# EAGLE design Transistor Tester (EAGLE 6.4)
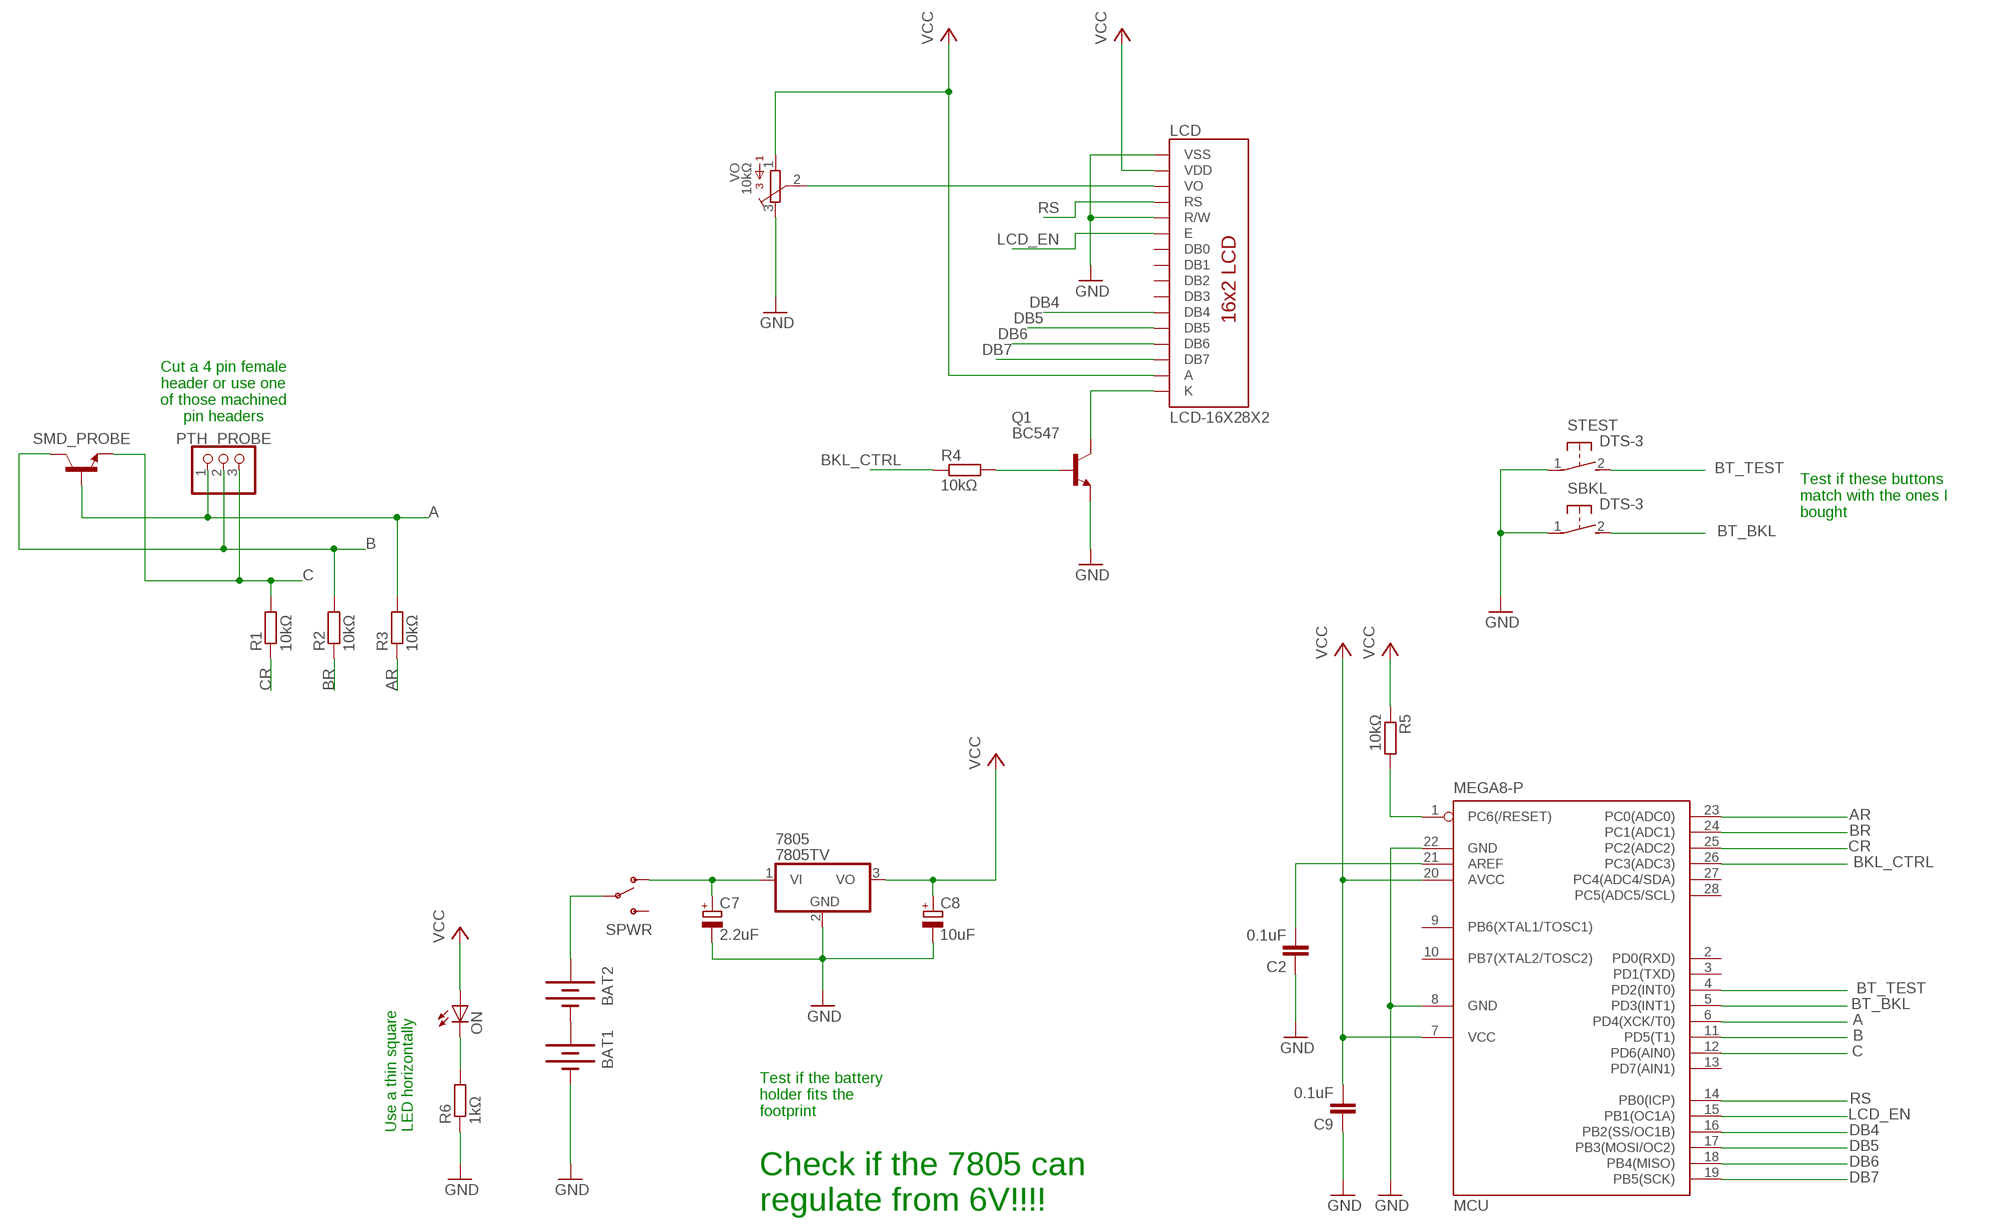
[diagram p0: schematic, sheet 1]

## Parts
7805  7805TV  [TO220V]
BAT1  20mm coincell  BATTERY20MM_4LEGS  [BATTCON_20MM_4LEGS]
BAT2  20mm coincell  BATTERY20MM_4LEGS  [BATTCON_20MM_4LEGS]
C2  0.1uF  C-EU025-025X050  [C025-025X050]
C7  2.2uF  CPOL-EUE2.5-6  [E2,5-6]
C8  10uF  CPOL-EUE2.5-6  [E2,5-6]
C9  0.1uF  C-EU050-025X075  [C050-025X075]
LCD  LCD-16X28X2  [LCD-8X2]
MCU  MEGA8-P  [DIL28-3]
ON  LED3MM  [LED3MM]
PTH_PROBE  PINHD-1X3  [1X03]
Q1  BC547  [TO92]
R1  10kΩ  R-EU_0207/10  [0207/10]
R2  10kΩ  R-EU_0207/10  [0207/10]
R3  10kΩ  R-EU_0207/10  [0207/10]
R4  10kΩ  R-EU_0207/10  [0207/10]
R5  10kΩ  R-EU_0207/10  [0207/10]
R6  1kΩ  R-EU_0207/10  [0207/10]
SBKL  DTS-3  [DTS-3]
SMD_PROBE  BC817-25SMD  [SOT23-BEC]
SPWR  SWITCH-SPDTPTH  [SWITCH-SPDT]
STEST  DTS-3  [DTS-3]
VO  10kΩ  3362H  [3362H]

## Nets
A: MCU.6(PD4(XCK/T0)) PTH_PROBE.1 R3.2 SMD_PROBE.B
AR: MCU.23(PC0(ADC0)) R3.1
B: MCU.11(PD5(T1)) PTH_PROBE.2 R2.2 SMD_PROBE.C
BKL_CTRL: MCU.26(PC3(ADC3)) R4.1
BR: MCU.24(PC1(ADC1)) R2.1
BT_BKL: MCU.5(PD3(INT1)) SBKL.2
BT_TEST: MCU.4(PD2(INT0)) STEST.2
C: MCU.12(PD6(AIN0)) PTH_PROBE.3 R1.2 SMD_PROBE.E
CR: MCU.25(PC2(ADC2)) R1.1
DB4: LCD.11(DB4) MCU.16(PB2(SS/OC1B))
DB5: LCD.12(DB5) MCU.17(PB3(MOSI/OC2))
DB6: LCD.13(DB6) MCU.18(PB4(MISO))
DB7: LCD.14(DB7) MCU.19(PB5(SCK))
GND: 7805.2(GND) BAT1.2(-) C2.1 C7.- C8.- C9.1 LCD.1(VSS) LCD.5(R/W) MCU.8(GND) MCU.22(GND) Q1.1(E) R6.1 SBKL.1 STEST.1 VO.3
LCD_EN: LCD.6(E) MCU.15(PB1(OC1A))
N$1: BAT1.1(+) BAT2.2(-)
N$2: C2.2 MCU.21(AREF)
N$3: LCD.16(K) Q1.3(C)
N$4: Q1.2(B) R4.2
N$5: ON.K(C) R6.2
N$6: BAT2.1(+) SPWR.2(P)
N$7: 7805.1(VI) C7.+ SPWR.1(O)
N$10: LCD.3(VO) VO.2
RESET: MCU.1(PC6(/RESET)) R5.2
RS: LCD.4(RS) MCU.14(PB0(ICP))
VCC: 7805.3(VO) C8.+ C9.2 LCD.2(VDD) LCD.15(A) MCU.7(VCC) MCU.20(AVCC) ON.A R5.1 VO.1
Unconnected: LCD.7(DB0) LCD.8(DB1) LCD.9(DB2) LCD.10(DB3) MCU.2(PD0(RXD)) MCU.3(PD1(TXD)) MCU.9(PB6(XTAL1/TOSC1)) MCU.10(PB7(XTAL2/TOSC2)) MCU.13(PD7(AIN1)) MCU.27(PC4(ADC4/SDA)) MCU.28(PC5(ADC5/SCL)) SPWR.3(S)

## Notes on the sheet
- Cut a 4 pin female
  header or use one
  of those machined
  pin headers
- Test if these buttons
  match with the ones I
  bought
- Test if the battery
  holder fits the
  footprint
- Use a thin square
  LED horizontally
- Check if the 7805 can
  regulate from 6V!!!!

## Library data of the parts
7805 = linear:78*: Positive VOLTAGE REGULATOR Source: http://cache.national.com/ds/LM/LM78L05.pdf http://www.fairchildsemi.com/ds/LM/LM7805.pdf
BAT1 BAT2 = SparkFun-Electromechanical:BATTERY: Battery Holders Various common sizes : AA, AAA, 20mm coin cell and 12mm coin cell. 20MM_4LEGS, BATT-10373; PROD_ID: BATT-10373
C2 C9 = rcl:C-EU: CAPACITOR, European symbol
C7 C8 = rcl:CPOL-EU: POLARIZED CAPACITOR, European symbol
LCD = SparkFun-Displays:LCD-16X2: Standard text-only 16x2 parallel input LCD
MCU = atmel:MEGA8-P: MICROCONTROLLER 8 Kbytes FLASH, 1 kbytes SRAM, 512 bytes EEPROM, USART, 4-channel 10 bit ADC, 2-channel 8 bit ADC Pin compatible with Atmega48, ATMega88, ATMega168 Source: avr.lbr; OC_FARNELL: unknown; OC_NEWARK: unknown
ON = led:LED: LED OSRAM: - CHIPLED LG R971, LG N971, LY N971, LG Q971, LY Q971, LO R971, LY R971 LH N974, LH R974 LS Q976, LO Q976, LY Q976 LO Q996 - Hyper CHIPLED LW Q18S LB Q993, LB Q99A, LB R99A - SideLED LS A670, LO A670, LY A670, LG A670, LP A670 LB A673, LV A673, LT A673, LW A673 LH A674 LY A675 LS A676, LA A676, LO A676, LY A676, LW A676 LS A679, LY A679, LG A679 - Hyper Micro SIDELED® LS Y876, LA Y876, LO Y876, LY Y876 LT Y87S - SmartLED LW L88C, LW L88S LB L89C, LB L89S, LG L890 LS L89K, LO L89K, LY L89K LS L896, LA L896, LO L896, LY L896 - TOPLED LS T670, LO T670, LY T670, LG T670, LP T670 LSG T670, LSP T670, LSY T670, LOP T670, LYG T670 LG T671, LOG T671, LSG T671 LB T673, LV T673, LT T673, LW T673 LH T674 LS T676, LA T676, LO T676, LY T676, LB T676, LH T676, LSB T676, LW T676 LB T67C, LV T67C, LT T67C, LS T67K, LO T67K, LY T67K, LW E67C LS E67B, LA E67B, LO E67B, LY E67B, LB E67C, LV E67C, LT E67C LW T67C LS T679, LY T679, LG T679 LS T770, LO T770, LY T770, LG T770, LP T770 LB T773, LV T773, LT T773, LW T773 LH T774 LS E675, LA E675, LY E675, LS T675 LS T776, LA T776, LO T776, LY T776, LB T776 LHGB T686 LT T68C, LB T68C - Hyper Mini TOPLED® LB M676 - Mini TOPLED Santana® LG M470 LS M47K, LO M47K, LY M47K Source: http://www.osram.convergy.de LUXEON: - LUMILED® LXK2-PW12-R00, LXK2-PW12-S00, LXK2-PW14-U00, LXK2-PW14-V00 LXK2-PM12-R00, LXK2-PM12-S00, LXK2-PM14-U00 LXK2-PE12-Q00, LXK2-PE12-R00, LXK2-PE12-S00, LXK2-PE14-T00, LXK2-PE14-U00 LXK2-PB12-K00, LXK2-PB12-L00, LXK2-PB12-M00, LXK2-PB14-N00, LXK2-PB14-P00, LXK2-PB14-Q00 LXK2-PR12-L00, LXK2-PR12-M00, LXK2-PR14-Q00, LXK2-PR14-R00 LXK2-PD12-Q00, LXK2-PD12-R00, LXK2-PD12-S00 LXK2-PH12-R00, LXK2-PH12-S00 LXK2-PL12-P00, LXK2-PL12-Q00, LXK2-PL12-R00 Source: www.luxeon.com KINGBRIGHT: KA-3528ASYC Source: www.kingbright.com
PTH_PROBE = pinhead:PINHD-1X3: PIN HEADER
Q1 = transistor-npn:BC547*: NPN Transistor
R1-R3 = resistor:R-EU_: RESISTOR, European symbol
R4-R6 = rcl:R-EU_: RESISTOR, European symbol
SBKL STEST = switch-tact:DTS-3
SMD_PROBE = transistor-npn:BC817*: NPN Transistor
SPWR = SparkFun-Electromechanical:SWITCH-SPDT: SPDT Switch Simple slide switch, Spark Fun Electronics SKU : COM-00102 DPDT SMT slide switch, AYZ0202, SWCH-08179
VO = bourns:3362: 3362 Series 1/4" Square Trimmer

## Board
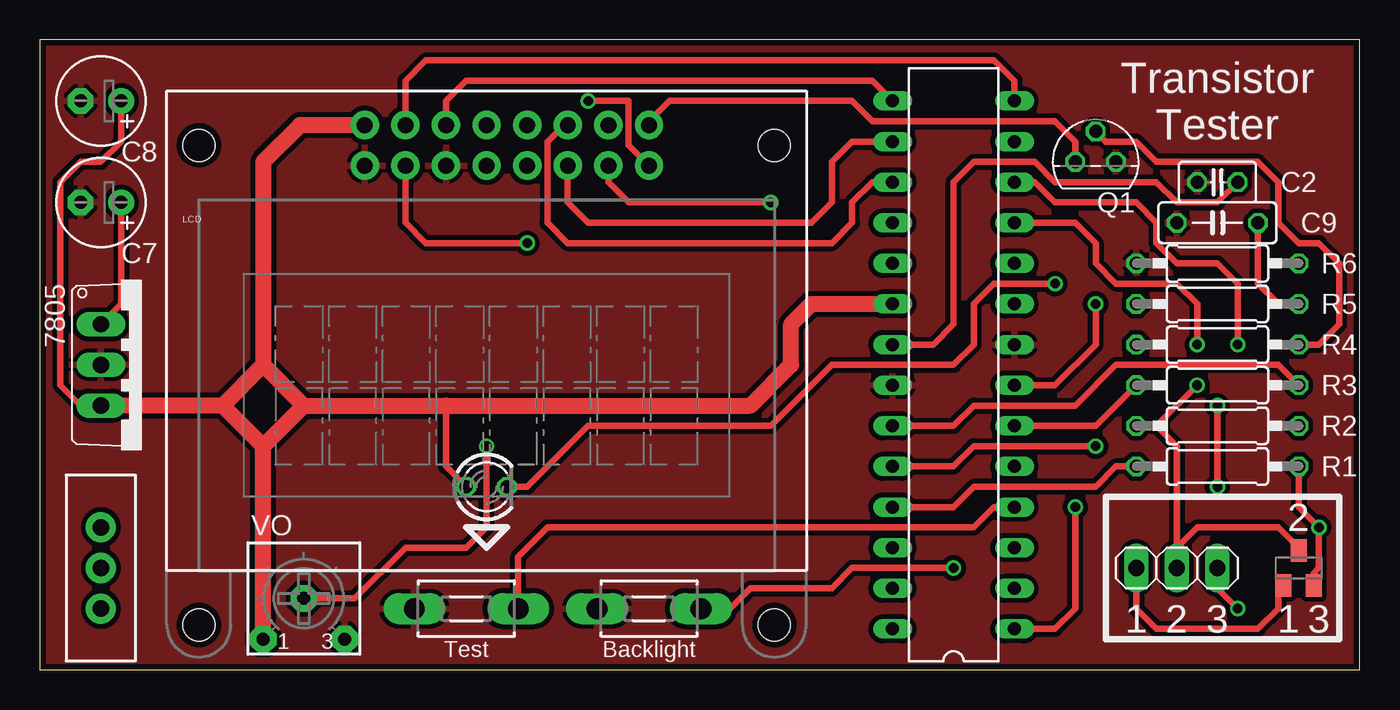
[diagram p1: board, top side]
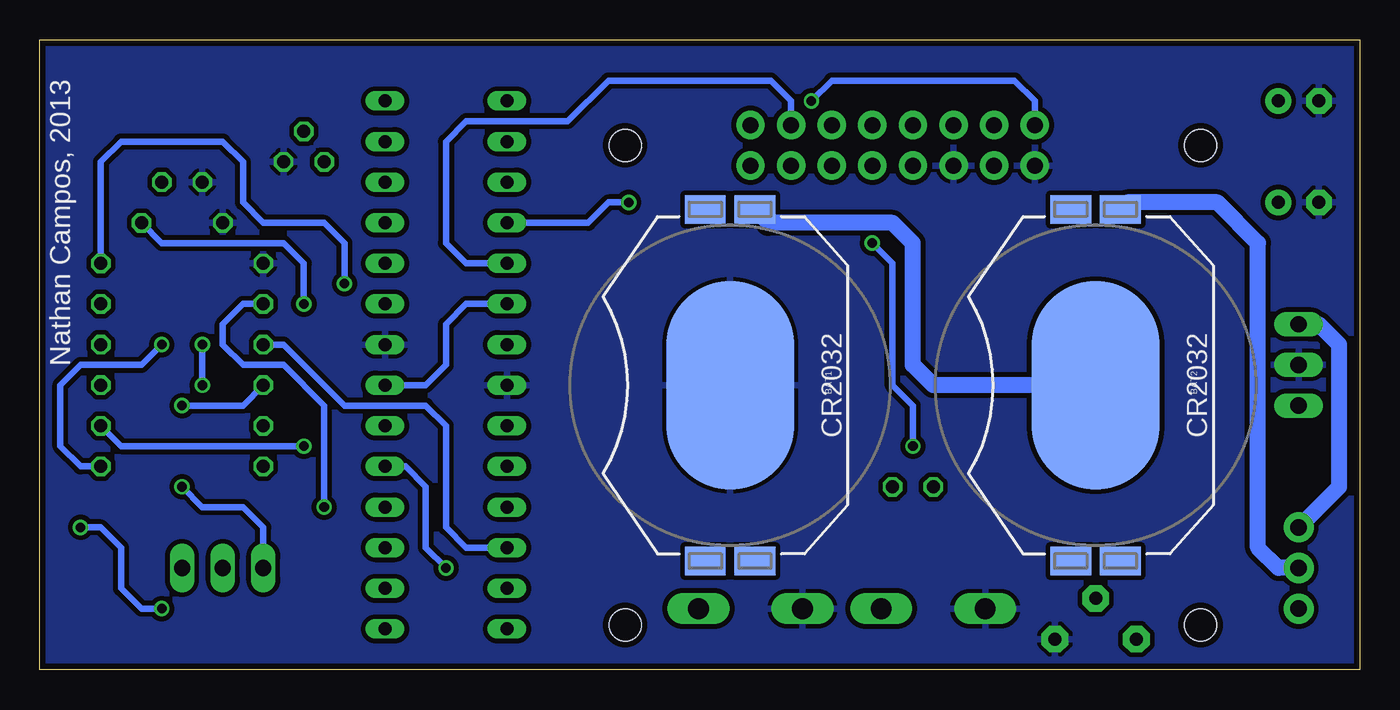
[diagram p2: board, bottom side, seen from below]

Size 82.55 x 39.37 mm. Coordinates in mm from the lower left corner, seen from the top.
Outline: 0,0 82.55,0 82.55,39.37 0,39.37 0,0
Copper layers (1*16): Top 0.0356mm / dielectric 1.5011mm / Bottom 0.0356mm
Design rules "LaenPCBOrder": minimum track width 6mil, minimum drill 13mil, track to track 6mil, track to pad 6mil, pad to pad 6mil, via to via 6mil, smd to smd 6mil, copper to edge 15mil, drill to drill 6mil, minimum pad ring 7mil, minimum via ring 7mil, stop-mask expansion 4mil, vias tented up to drill 0mil, thermal gap 10mil

### Footprints (pad centres in the part's own frame; a part is rotated, then mirrored left to right if it is on the bottom)
TO220V = drill 1.016 long: 1 -2.54,-2.54; 2 0,-2.54; 3 2.54,-2.54
BATTCON_20MM_4LEGS = smd 1.778 x 2.54: 1 -11,1.55; 3 11,1.55; P$1 -11,-1.55; P$2 11,-1.55 | smd 13 x 8: 2 0,0
C025-025X050 = drill 0.813 octagon: 1 -1.27,0; 2 1.27,0
E2,5-6 = drill 0.813 pad 1.6: + -1.27,0 | drill 0.813 pad 1.6 octagon: - 1.27,0
C050-025X075 = drill 0.813 octagon: 1 -2.54,0; 2 2.54,0
LCD-8X2 = drill 1 pad 1.778: 1 -7.62,13.73; 2 -7.62,16.27; 3 -5.08,13.73; 4 -5.08,16.27; 5 -2.54,13.73; 6 -2.54,16.27; 7 0,13.73; 8 0,16.27; 9 2.54,13.73; 10 2.54,16.27; 11 5.08,13.73; 12 5.08,16.27; 13 7.62,13.73; 14 7.62,16.27; 15 10.16,13.73; 16 10.16,16.27 | hole 2: 18,15; -18,15; -18,-15; 18,-15
DIL28-3 = drill 0.813 long: 1 -16.51,-3.81; 2 -13.97,-3.81; 3 -11.43,-3.81; 4 -8.89,-3.81; 5 -6.35,-3.81; 6 -3.81,-3.81; 7 -1.27,-3.81; 8 1.27,-3.81; 9 3.81,-3.81; 10 6.35,-3.81; 11 8.89,-3.81; 12 11.43,-3.81; 13 13.97,-3.81; 14 16.51,-3.81; 15 16.51,3.81; 16 13.97,3.81; 17 11.43,3.81; 18 8.89,3.81; 19 6.35,3.81; 20 3.81,3.81; 21 1.27,3.81; 22 -1.27,3.81; 23 -3.81,3.81; 24 -6.35,3.81; 25 -8.89,3.81; 26 -11.43,3.81; 27 -13.97,3.81; 28 -16.51,3.81
LED3MM = drill 0.813 octagon: A -1.27,0; K 1.27,0
1X03 = drill 1.016 long: 1 -2.54,0; 2 0,0; 3 2.54,0
TO92 = drill 0.813 octagon: 1 1.27,0; 2 0,1.905; 3 -1.27,0
0207/10 = drill 0.813 octagon: 1 -5.08,0; 2 5.08,0
DTS-3 = drill 1.3 long: 1 -3.25,0; 2 3.25,0
SOT23-BEC = smd 1 x 1.4: B -0.95,-1.1; C 0,1.1; E 0.95,-1.1
SWITCH-SPDT = drill 1.016 pad 1.88: 1 0,2.54; 2 0,0; 3 0,-2.54
3362H = drill 0.813 pad 1.676 octagon: 1 -2.54,-3.175; 2 0,-0.635; 3 2.54,-3.175

### Placement (x,y rotation side)
7805  6.35,19.05 270 top
BAT1  39.37,17.78 270 bottom
BAT2  16.51,17.78 270 bottom
C2  73.66,30.48 0 top
C7  3.81,29.21 180 top
C8  3.81,35.56 180 top
C9  73.66,27.94 0 top
LCD  27.94,17.78 0 top
MCU  57.15,19.05 90 top
ON  27.94,11.43 0 top
PTH_PROBE  71.12,6.35 0 top
Q1  66.04,31.75 0 top
R1  73.66,12.7 0 top
R2  73.66,15.24 180 top
R3  73.66,17.78 180 top
R4  73.66,20.32 0 top
R5  73.66,22.86 180 top
R6  73.66,25.4 0 top
SBKL  38.1,3.81 0 top
SMD_PROBE  78.74,6.35 0 top
SPWR  3.81,6.35 0 top
STEST  26.67,3.81 0 top
VO  16.51,5.08 0 top

### Tracks (layer width: path | path; a pad name or v marks a point on that pad's centre or on a via)
A  (via drill 0.6)
  Top 0.406: PTH_PROBE.1 68.58,3.81 69.85,2.54 76.2,2.54 77.47,3.81 77.47,4.93 SMD_PROBE.B | MCU.6 66.04,15.24 R3.2 | v73.66,16.51 v73.66,11.43
  Bottom 0.406: R3.2 69.85,16.51 v73.66,16.51 | PTH_PROBE.1 68.58,8.89 69.85,10.16 72.39,10.16 v73.66,11.43
AR
  Top 0.406: MCU.23 57.15,15.24 58.42,16.51 64.77,16.51 67.31,19.05 77.47,19.05 R3.1
B  (via drill 0.6)
  Top 0.406: PTH_PROBE.2 71.12,7.62 | 71.12,7.62 72.39,8.89 77.47,8.89 78.74,7.62 SMD_PROBE.C | 69.85,15.24 71.12,13.97 71.12,7.62 | MCU.11 64.77,27.94 66.04,26.67 66.04,25.4 67.31,24.13 71.12,24.13 72.39,22.86 v72.39,20.32 | R2.2 69.85,15.24 | 69.85,15.24 v72.39,17.78
  Bottom 0.406: v72.39,17.78 v72.39,20.32
BKL_CTRL
  Bottom 0.406: MCU.26 55.88,7.62 57.15,8.89 57.15,15.24 58.42,16.51 63.5,16.51 67.31,20.32 R4.1
BR  (via drill 0.6)
  Top 0.406: MCU.24 57.15,12.7 58.42,13.97 v66.04,13.97
  Bottom 0.406: R2.1 77.47,13.97 v66.04,13.97
BT_BKL  (via drill 0.6)
  Top 0.406: SBKL.2 43.18,3.81 44.45,5.08 49.53,5.08 50.8,6.35 v57.15,6.35
  Bottom 0.406: MCU.5 59.69,12.7 58.42,11.43 58.42,7.62 v57.15,6.35
BT_TEST
  Top 0.406: STEST.2 29.92,7.06 31.75,8.89 58.42,8.89 59.69,10.16 MCU.4
C  (via drill 0.6)
  Top 0.406: PTH_PROBE.3 73.66,5.08 v74.93,3.81 | SMD_PROBE.E 79.69,6.03 80.01,6.35 v80.01,8.89 78.74,10.16 R1.2 | MCU.12 62.23,30.48 63.5,29.21 68.58,29.21 69.85,27.94 69.85,26.67 71.12,25.4 73.66,25.4 74.93,24.13 v74.93,20.32
  Bottom 0.406: v74.93,3.81 76.2,3.81 77.47,5.08 77.47,7.62 78.74,8.89 v80.01,8.89 | R1.2 80.01,12.7 81.28,13.97 81.28,17.78 80.01,19.05 76.2,19.05 v74.93,20.32
CR
  Top 0.406: R1.1 67.31,12.7 66.04,11.43 58.42,11.43 57.15,10.16 MCU.25
DB4
  Top 0.406: LCD.11 33.02,29.21 34.29,27.94 48.26,27.94 49.53,29.21 49.53,31.75 50.8,33.02 MCU.16
DB5
  Top 0.406: LCD.12 32.78,34.05 31.75,33.02 31.75,27.94 33.02,26.67 49.53,26.67 50.8,27.94 50.8,29.21 52.07,30.48 MCU.17
DB6  (via drill 0.6)
  Top 0.406: LCD.13 35.56,30.48 36.83,29.21 v45.72,29.21
  Bottom 0.406: v45.72,29.21 46.99,29.21 48.26,27.94 MCU.18
DB7
  Bottom 0.406: LCD.14 35.56,35.56 36.83,36.83 46.99,36.83 49.53,34.29 55.88,34.29 57.15,33.02 57.15,26.67 55.88,25.4 MCU.19
GND
  pour Top (isolate 0.305): 0,39.37 82.55,39.37 82.55,0 0,0
  pour Bottom (isolate 0.305): 0,0 0,39.37 82.55,39.37 82.55,0
LCD_EN
  Top 0.406: LCD.6 25.4,35.56 26.67,36.83 52.07,36.83 MCU.15
N$1
  Bottom 1.016: BAT2.2 26.67,17.78 27.94,19.05 27.94,26.67 29.21,27.94 36.98,27.94 BAT1.1
N$2
  Top 0.406: MCU.21 55.88,20.32 57.15,21.59 57.15,30.48 58.42,31.75 62.23,31.75 63.5,30.48 69.85,30.48 71.12,29.21 73.66,29.21 C2.2
N$3
  Top 0.406: LCD.16 38.1,34.29 39.37,35.56 50.8,35.56 52.07,34.29 63.5,34.29 64.77,33.02 Q1.3
N$4
  Top 0.406: Q1.2 66.67,33.02 68.58,33.02 69.85,31.75 76.2,31.75 77.47,30.48 77.47,27.94 78.74,26.67 80.01,26.67 81.28,25.4 81.28,21.59 80.01,20.32 R4.2
N$5  (via drill 0.6)
  Top 0.406: ON.K 30.48,11.43 34.29,15.24 45.72,15.24 49.53,19.05 57.15,19.05 58.42,20.32 58.42,22.86 59.69,24.13 v63.5,24.13
  Bottom 0.406: v63.5,24.13 63.5,26.67 64.77,27.94 68.58,27.94 69.85,29.21 69.85,31.75 71.12,33.02 77.47,33.02 78.74,31.75 R6.2
N$6
  Bottom 1.016: SPWR.2 5.08,6.35 6.35,7.62 6.35,26.67 8.89,29.21 14.53,29.21 BAT2.1
N$7
  Top 0.406: C7.+ 5.08,22.86 7805.1
  Bottom 1.016: SPWR.1 1.27,11.43 1.27,20.32 2.54,21.59 7805.1
N$10  (via drill 0.6)
  Top 0.406: VO.2 19.68,4.45 22.86,7.62 26.67,7.62 27.94,8.89 v27.94,13.97 | v30.48,26.67 24.13,26.67 22.86,27.94 LCD.3
  Bottom 0.406: v27.94,13.97 27.94,16.51 29.21,17.78 29.21,25.4 v30.48,26.67
RESET  (via drill 0.6)
  Top 0.406: MCU.1 63.5,2.54 64.77,3.81 v64.77,10.16
  Bottom 0.406: v64.77,10.16 64.77,16.51 67.31,19.05 69.85,19.05 71.12,20.32 71.12,21.59 69.85,22.86 R5.2
RS
  Top 0.406: LCD.4 22.86,36.83 24.13,38.1 59.69,38.1 60.96,36.83 MCU.14
VCC  (via drill 0.6)
  Top 0.406: C8.+ 5.08,33.02 3.81,31.75 2.54,31.75 1.27,30.48 1.27,17.78 2.54,16.51 7805.3 | ON.A 25.4,12.7 25.4,16.51 | MCU.7 63.5,17.78 66.04,20.32 v66.04,22.86 | R5.1 77.47,22.86 76.2,24.13 C9.2 | v34.29,35.56 36.83,35.56 36.83,32.78 LCD.15
  Top 1.016: VO.1 13.97,13.97 | 13.97,13.97 11.43,16.51 | 11.43,16.51 7805.3 | 13.97,13.97 16.51,16.51 | 16.51,16.51 25.4,16.51 44.45,16.51 46.99,19.05 46.99,21.59 48.26,22.86 MCU.20 | LCD.2 16.27,34.05 13.97,31.75 13.97,19.05 | 13.97,19.05 11.43,16.51 | 16.51,16.51 13.97,19.05
  Bottom 0.406: MCU.7 58.42,17.78 57.15,19.05 57.15,21.59 55.88,22.86 MCU.20 | v66.04,22.86 66.04,25.4 67.31,26.67 74.93,26.67 C9.2 | LCD.2 20.32,35.56 21.59,36.83 33.02,36.83 v34.29,35.56

### Text on the board
tPlace: Transistor / Tester | 2 | 1 | 2 | 3 | 1 | 3 | Test | Backlight
bPlace: Nathan Campos, 2013 | CR2032 | CR2032